# Altium project Control.PrjPcb
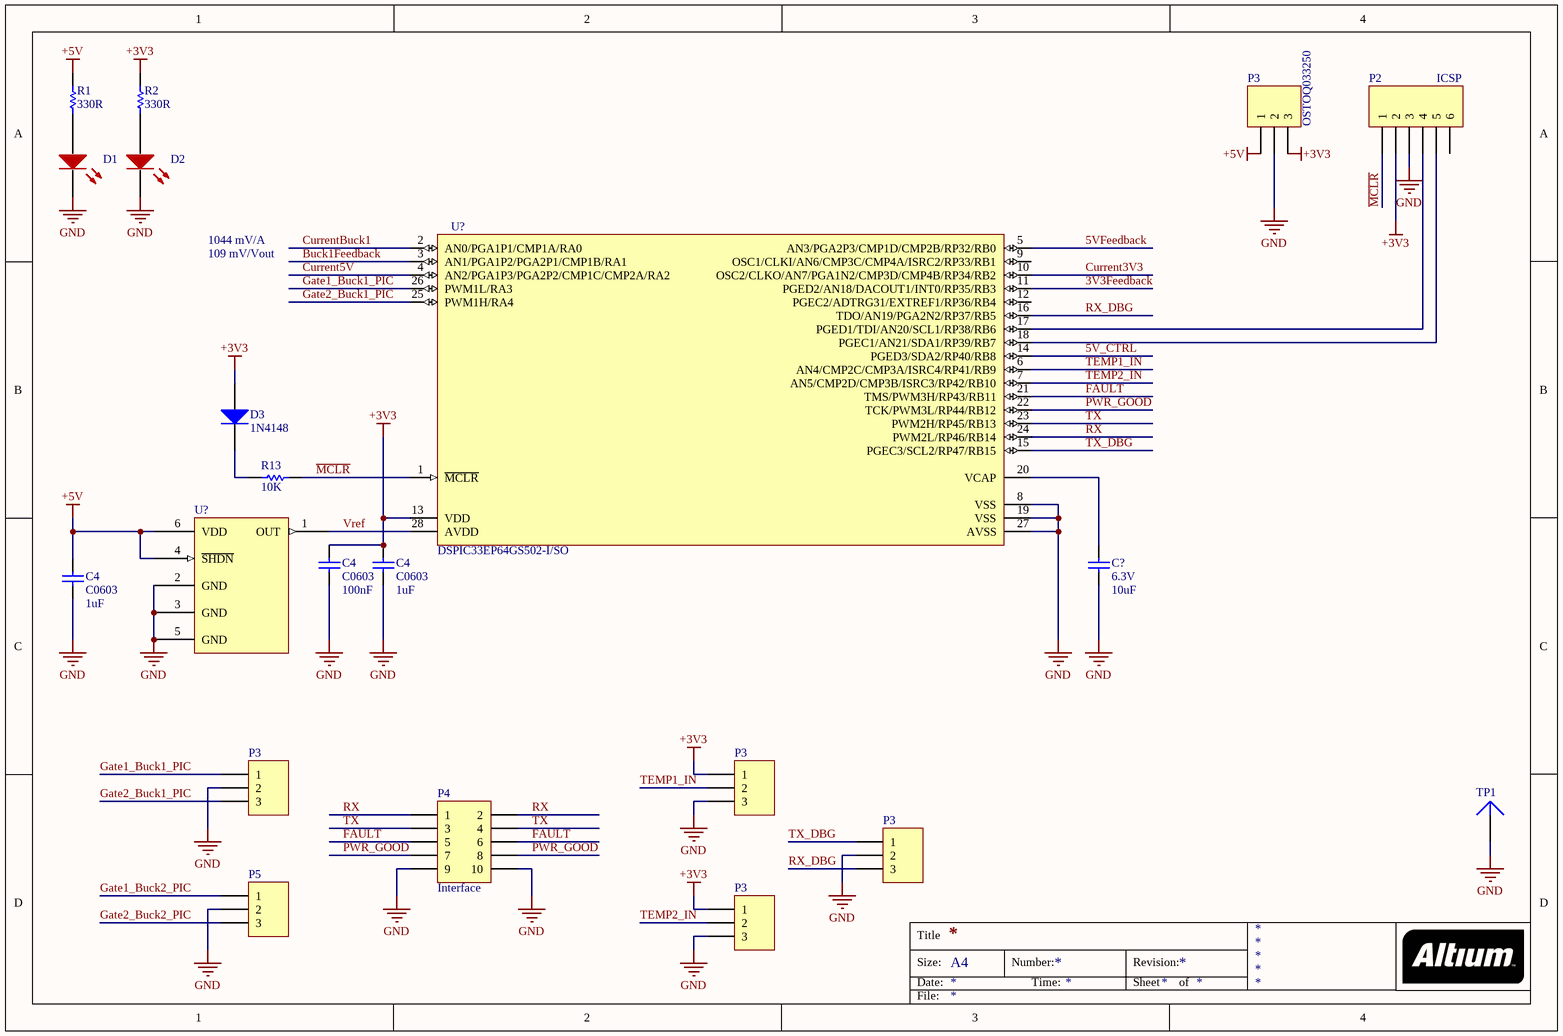
[diagram p0: Control.SchDoc]
2 sheets, 61 parts. Net scope: global (net labels, ports and power ports of the same name join across sheets).
Board file: Control.PcbDoc
Sheets:
  Control.SchDoc
  Remote Feedback.SchDoc

## Sheet Control.SchDoc
size A4

### Parts
(Parts that share a designator on the sheet are numbered #1, #2 ... from top to bottom, then left to right.)
C4#1  C0603  value 100nF  [0603]
C4#2  C0603  value 1uF  [0603]
C4#3  C0603  value 1uF  [0603]
C?#1  6.3V  value 10uF  [C0805]
D1  15-21SURC/S530-A3/TR8  [15-21SURC/S530-A3/TR8]  (value not drawn)
D2  15-21SURC/S530-A3/TR8  [15-21SURC/S530-A3/TR8]  (value not drawn)
D3  1N4148  [SOD80C]
P2  ICSP  [My_1X06]
P3#1  XY2500R-F 3P  [OSTOQ033250]  (value not drawn)
P3#2  Header 3  [My_1X03]  (value not drawn)
P3#3  Header 3  [My_1X03]  (value not drawn)
P3#4  Header 3  [My_1X03]  (value not drawn)
P3#5  Header 3  [My_1X03]  (value not drawn)
P4  Interface  [HDR2X5]
P5  Header 3  [My_1X03]  (value not drawn)
R1  value 330R  [8RB-1206]  (hidden comment: SMD)
R2  value 330R  [8RB-1206]  (hidden comment: SMD)
R13#1  10K  [ERA-0603]
TP1  (no value)  [PIN1]
U?#1  Manufacturer Part Number: DSPIC33EP64GS502-I/SO  [MCHP-SOIC-SO28_N]  (hidden comment: DSPIC33EP64GS502)
U?#2  MCP1501T  [SOT-23-6]  (value not drawn)

### Nets
+3V3: C4#1.1 C4#2.1 D3.1(A) P2.2 P3#1.3 P3#3.1 P3#5.1 R2.1 U?#1.13(VDD)
+5V: C4#3.1 P3#1.1 R1.1 U?#2.4(~{SHDN}) U?#2.6(VDD)
GND: C4#1.2 C4#2.2 C4#3.2 C?#1.1 D1.2 D2.2 P2.3 P3#1.2 P3#2.2 P3#3.3 P3#4.2 P3#5.3 P4.9 P4.10 P5.2 TP1.1 U?#1.8(VSS) U?#1.19(VSS) U?#1.27(AVSS) U?#2.2(GND) U?#2.3(GND) U?#2.5(GND)
3V3Feedback: U?#1.11(PGED2/AN18/DACOUT1/INT0/RP35/RB3)
5V_CTRL: U?#1.14(PGED3/SDA2/RP40/RB8)
5VFeedback: U?#1.5(AN3/PGA2P3/CMP1D/CMP2B/RP32/RB0)
Buck1Feedback: U?#1.3(AN1/PGA1P2/PGA2P1/CMP1B/RA1)
Current3V3: U?#1.10(OSC2/CLKO/AN7/PGA1N2/CMP3D/CMP4B/RP34/RB2)
Current5V: U?#1.4(AN2/PGA1P3/PGA2P2/CMP1C/CMP2A/RA2)
CurrentBuck1: U?#1.2(AN0/PGA1P1/CMP1A/RA0)
FAULT: P4.5 P4.6 U?#1.21(TMS/PWM3H/RP43/RB11)
Gate1_Buck1_PIC: P3#2.1 U?#1.26(PWM1L/RA3)
Gate1_Buck2_PIC: P5.1
Gate2_Buck1_PIC: P3#2.3 U?#1.25(PWM1H/RA4)
Gate2_Buck2_PIC: P5.3
~{MCLR}: P2.1 R13#1.1 U?#1.1(~{MCLR})
PWR_GOOD: P4.7 P4.8 U?#1.22(TCK/PWM3L/RP44/RB12)
RX: P4.1 P4.2 U?#1.24(PWM2L/RP46/RB14)
RX_DBG: P3#4.3 U?#1.16(TDO/AN19/PGA2N2/RP37/RB5)
TEMP1_IN: P3#3.2 U?#1.6(AN4/CMP2C/CMP3A/ISRC4/RP41/RB9)
TEMP2_IN: P3#5.2 U?#1.7(AN5/CMP2D/CMP3B/ISRC3/RP42/RB10)
TX: P4.3 P4.4 U?#1.23(PWM2H/RP45/RB13)
TX_DBG: P3#4.1 U?#1.15(PGEC3/SCL2/RP47/RB15)
Vref: U?#1.28(AVDD) U?#2.1(OUT)
NetC?#1_2: C?#1.2 U?#1.20(VCAP)
NetD1_1: D1.1 R1.2
NetD2_1: D2.1 R2.2
NetD3_2: D3.2(K) R13#1.2
NetP2_4: P2.4 U?#1.17(PGED1/TDI/AN20/SCL1/RP38/RB6)
NetP2_5: P2.5 U?#1.18(PGEC1/AN21/SDA1/RP39/RB7)

Not connected (* = marked no-connect by the designer): P2 6; U?#1 9(OSC1/CLKI/AN6/CMP3C/CMP4A/ISRC2/RP33/RB1) 12(PGEC2/ADTRG31/EXTREF1/RP36/RB4)

### Notes on the sheet
- 1044 mV/A
- 109 mV/Vout
- Title
- Size:
- Date:
- A4
- Number:
- Time:
- Revision:
- Sheet
- of
- File:

### Library data of the parts
C4#1-C4#3 = C0603: C1608X7R1C105K X7R; Note: Footprint corresponds to dimensions for bulk cassette packaging. This case size has tightened tolerances.; Published: 17-Jul-2002; LatestRevisionDate: 19-Mar-2004; LatestRevisionNote: Silkscreen size reduced.; DatasheetDocument: Mar-2001; PackageDocument: Mar-2001; PackageReference: 0603; Publisher: Altium Limited; Code_JEITA: 0603; Code_IPC: 1608 [0603]; ComponentLink1Description: Manufacturer Link; ComponentLink1URL: http://www.kemet.com/; ComponentLink2Description: Datasheet; ComponentLink2URL: http://www.kemet.com/kemet/web/homepage/kechome.nsf/vapubfilesname/F3102TA.pdf/$file/F3102TA.pdf
C?#1 = CDR01: Ceramic Chip Capacitor - MIL-PRF-55681; Published: 17-Jul-2002; LatestRevisionDate: 19-Mar-2004; LatestRevisionNote: Silkscreen size reduced.; DatasheetDocument: Mar-2001; PackageDocument: Mar-2001; PackageReference: C0805; Publisher: Altium Limited; Code_JEITA: 0805; Code_IPC: 2012[0805]; ComponentLink1Description: Manufacturer Link; ComponentLink1URL: http://www.kemet.com/; ComponentLink2Description: Datasheet; ComponentLink2URL: http://www.kemet.com/kemet/web/homepage/kechome.nsf/vapubfilesname/F3102TA.pdf/$file/F3102TA.pdf
D1 D2 = 15-21SURC/S530-A3/TR8 led smd 0805 red
D3 = 1N4148: High Conductance Fast Diode; Published: 8-Jun-2000; LatestRevisionDate: 17-Jul-2002; LatestRevisionNote: Re-released for DXP Platform.; DatasheetDocument: 1997; PackageReference: DO-35; Publisher: Altium Limited; Code_JEDEC: DO-204-AH; ComponentLink1Description: Manufacturer Link; ComponentLink1URL: http://www.fairchildsemi.com/; ComponentLink2Description: Datasheet; ComponentLink2URL: http://www.fairchildsemi.com/ds/1N%2F1N4148.pdf
P2 = Header 6: Header, 6-Pin; LatestRevisionDate: 17-Jul-2002; LatestRevisionNote: Re-released for DXP Platform.; Publisher: Altium Limited
P3#1 = XY2500R-F 3P: HEADER 3P P/CI 90gra VERDE P=3.81MM XY2500R-F; Manufacturer: On Shore Technology Inc.; Material Flammability Rating: UL94 V-0; Voltage - UL: 300V; Current - UL: 10A; Pitch: 0.150" (3.81mm); Number of Levels: 1; Positions Per Level: 3; Header Orientation: Vertical; Contact Tail Length: 0.138" (3.50mm); Supplier 1: Digi-Key; Manufacturer Part Number: OSTOQ033250; Wire Strip Length: -; Termination Style: Solder; Mounting Type: Through Hole; Supplier: Digi-Key; Category: Connectors, Interconnects; Supplier Part Number: ED2820-ND; Voltage - IEC: -; Operating Temperature: -30°C ~ 105°C; Color: Green; Features: -; Ingress Protection: -; Wire Gauge or Range - mm²: -; Insulation Height: 0.362" (9.20mm); Wire Gauge or Range - AWG: -; Plug Wire Entry: -; Screw Size: -; Contact Mating Finish: Tin; Torque - Screw: -; Housing Material: Thermoplastic; Current - IEC: -; Contact Material: Brass; RoHS: RoHS Compliant; Part Status: Active; Packaging: Bulk; Type: Header, Male Pins, Shrouded (4 Side); Number of Positions: 3
P3#2-P3#5 P5 = Header 3: Header, 3-Pin; LatestRevisionDate: 17-Jul-2002; LatestRevisionNote: Re-released for DXP Platform.; Publisher: Altium Limited
P4 = Header 5X2: Header, 5-Pin, Dual row; LatestRevisionDate: 17-Jul-2002; LatestRevisionNote: Re-released for DXP Platform.; Publisher: Altium Limited
R1 R2 = ERJ8BQ: Low Ohmic Value Thick Film Chip Resistor, 0.22 Ohm to 9.1 Ohm Range, 1%, 2% and 5% Tolerance, 1206 Size, 0.33 W; Published: 17-Dec-2003; LatestRevisionDate: 19-Mar-2004; LatestRevisionNote: Silkscreen size reduced.; PackageDocument: Mar-2003; PackageReference: 8RB-1206; Publisher: Altium Limited; Code_IPC: 3216 [1206]; ComponentLink1Description: Manufacturer Link; ComponentLink1URL: http://www.panasonic.com/industrial/components/resistive_products.htm; ComponentLink2Description: Datasheet; ComponentLink2URL: http://www.panasonic.com/industrial/components/pdf/AOA0000CE3.pdf
R13#1 = ERA3Y: Rectangular Thick Film Chip Resistor, 10 Ohm to 330k Ohm Range, 0.1% and 0.5% Tolerance, 0603 Size, 0.063 W; Note: If flow soldering, adjust pad width of PCB Footprint to 0.7 - 0.8 times the width of the resistor.; Published: 17-Dec-2003; LatestRevisionDate: 19-Mar-2004; LatestRevisionNote: Silkscreen size reduced.; PackageDocument: Mar-2003; PackageReference: ERA-0603; Publisher: Altium Limited; Code_IPC: 1608 [0603]; ComponentLink1Description: Manufacturer Link; ComponentLink1URL: http://www.panasonic.com/industrial/components/resistive_products.htm; ComponentLink2Description: Datasheet; ComponentLink2URL: http://www.panasonic.com/industrial/components/pdf/AOA0000CE8.pdf
TP1 = Plug: LatestRevisionDate: 17-Jul-2002; LatestRevisionNote: Re-released for DXP Platform.; Publisher: Altium Limited
U?#1 = DSPIC33EP64GS502: dsPIC dsPIC™ 33EP Microcontroller IC 16-Bit 70 MIPs 64KB (64K x 8) FLASH 28-SOIC; Manufacturer: Microchip Technology; Number of I/O: 21; Peripherals: Brown-out Detect/Reset, POR, PWM, WDT; Oscillator Type: Internal; Speed: 70 MIPs; Voltage - Supply (Vcc/Vdd): 3 V ~ 3.6 V; Data Converters: A/D 12x12b, D/A 1x12b; Connectivity: I²C, IrDA, LIN, SPI, UART/USART; RAM Size: 8K x 8; Package / Case: 28-SOIC (0.295", 7.50mm Width); Supplier Device Package: 28-SOIC; Program Memory Size: 64KB (64K x 8); Operating Temperature: -40°C ~ 85°C (TA); Core Processor: dsPIC; Category: Integrated Circuits (ICs); Program Memory Type: FLASH; Core Size: 16-Bit; Packaging: Tube; EEPROM Size: -; RoHS: RoHS Compliant; Part Status: Active; Supplier: Digi-Key; Supplier Part Number: DSPIC33EP64GS502-I/SO-ND
U?#2 = MCP1501T: Series Voltage Reference IC ±0.08% 20mA SOT-23-6

## Sheet Remote Feedback.SchDoc
size A3
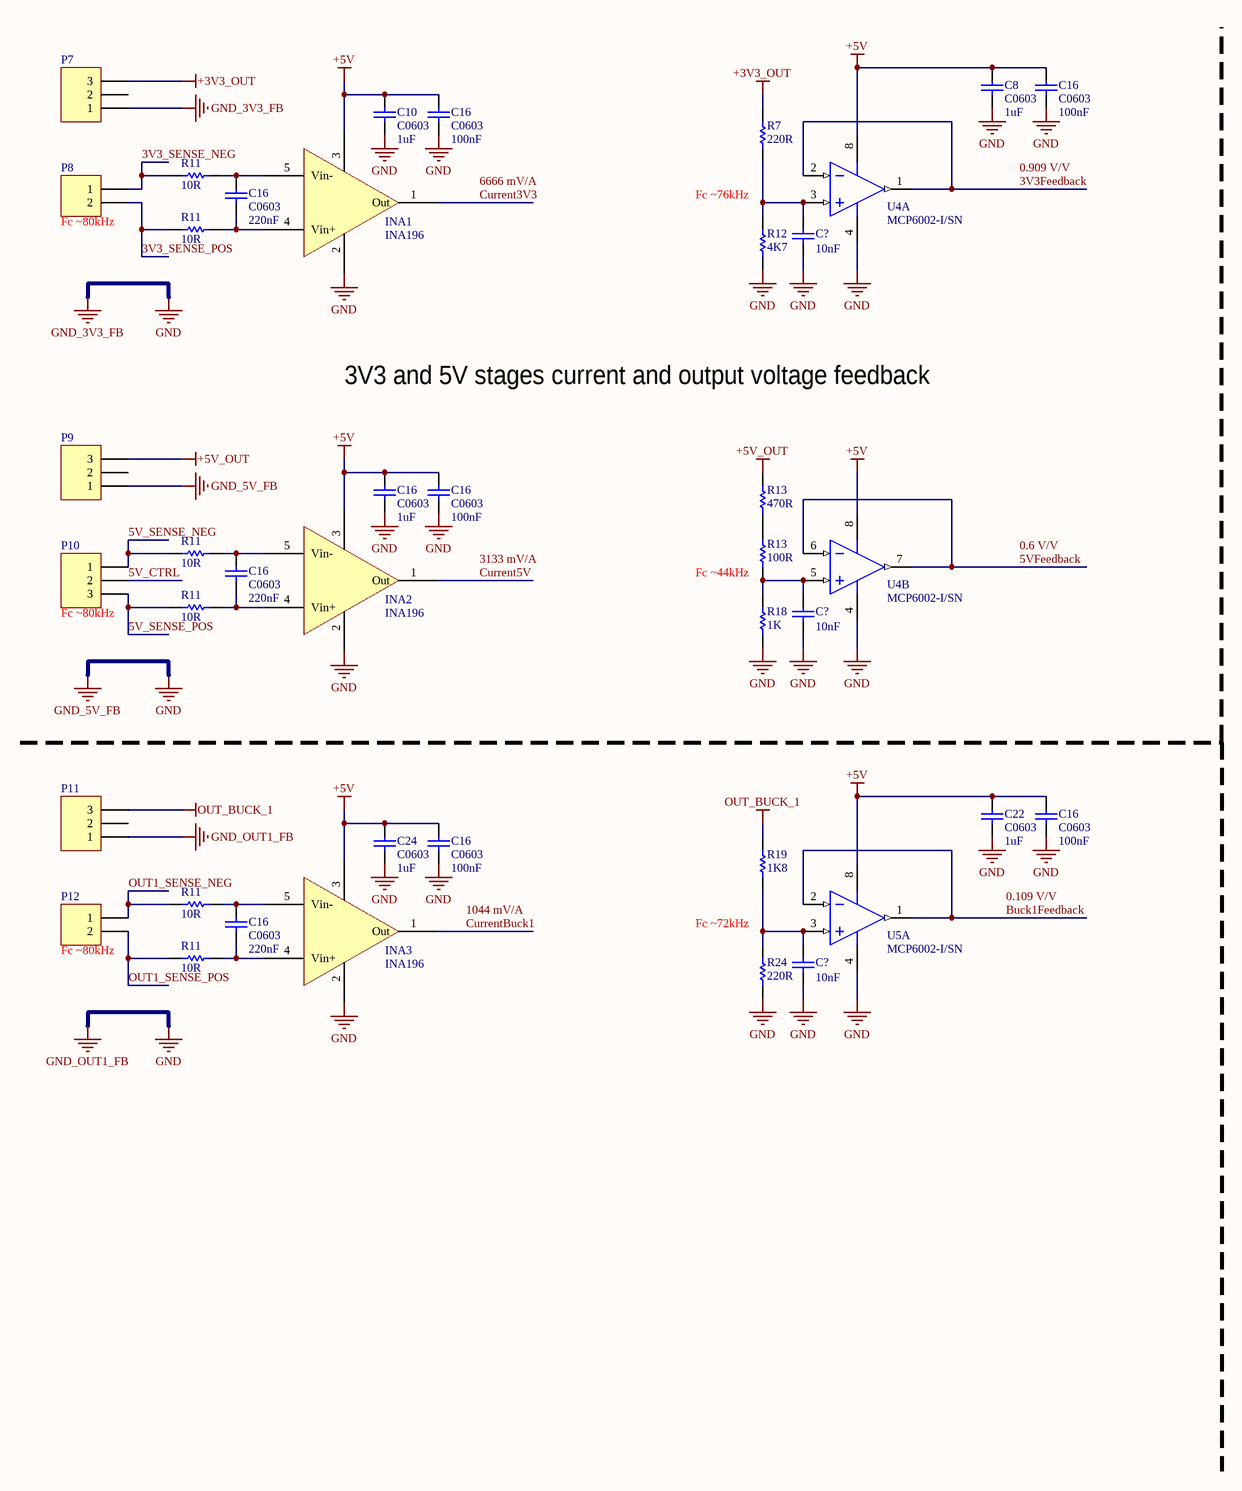
[diagram p1: Remote Feedback.SchDoc]

### Parts
(Parts that share a designator on the sheet are numbered #1, #2 ... from top to bottom, then left to right.)
C8  C0603  value 1uF  [0603]
C10  C0603  value 1uF  [0603]
C16#1  C0603  value 100nF  [0603]
C16#2  C0603  value 100nF  [0603]
C16#3  C0603  value 220nF  [0603]
C16#4  C0603  value 1uF  [0603]
C16#5  C0603  value 100nF  [0603]
C16#6  C0603  value 220nF  [0603]
C16#7  C0603  value 100nF  [0603]
C16#8  C0603  value 100nF  [0603]
C16#9  C0603  value 220nF  [0603]
C22  C0603  value 1uF  [0603]
C24  C0603  value 1uF  [0603]
C?#2  value 10nF  [C0805]  (hidden comment: CDR01)
C?#3  value 10nF  [C0805]  (hidden comment: CDR01)
C?#4  value 10nF  [C0805]  (hidden comment: CDR01)
INA1  INA196  [SOT-23-5]
INA2  INA196  [SOT-23-5]
INA3  INA196  [SOT-23-5]
P7  Header 3  [My_1X03]  (value not drawn)
P8  Header 2  [HDR1X2]  (value not drawn)
P9  Header 3  [My_1X03]  (value not drawn)
P10  Header 3  [My_1X03]  (value not drawn)
P11  Header 3  [My_1X03]  (value not drawn)
P12  Header 2  [HDR1X2]  (value not drawn)
R7  value 220R  [8RB-1206]  (hidden comment: SMD)
R11#1  10R  [ERA-0603]
R11#2  10R  [ERA-0603]
R11#3  10R  [ERA-0603]
R11#4  10R  [ERA-0603]
R11#5  10R  [ERA-0603]
R11#6  10R  [ERA-0603]
R12  value 4K7  [8RB-1206]  (hidden comment: SMD)
R13#2  value 470R  [8RB-1206]  (hidden comment: SMD)
R13#3  value 100R  [8RB-1206]  (hidden comment: SMD)
R18  value 1K  [8RB-1206]  (hidden comment: SMD)
R19  value 1K8  [8RB-1206]  (hidden comment: SMD)
R24  value 220R  [8RB-1206]  (hidden comment: SMD)
U4  MCP6002-I/SN  [SOIC-SN8_N]  (parts A,B of 2)
U5  MCP6002-I/SN  [SOIC-SN8_N]  (part A of 2)

### Nets
+3V3_OUT: P7.3 R7.2
+5V: C8.2 C10.2 C16#1.2 C16#2.2 C16#4.2 C16#5.2 C16#7.2 C16#8.2 C22.2 C24.2 INA1.3 INA2.3 INA3.3 U4.8(VDD) U5.8(VDD)
+5V_OUT: P9.3 R13#2.2
GND: C8.1 C10.1 C16#1.1 C16#2.1 C16#4.1 C16#5.1 C16#7.1 C16#8.1 C22.1 C24.1 C?#2.1 C?#3.1 C?#4.1 INA1.2(GND) INA2.2(GND) INA3.2(GND) P7.1 P9.1 P11.1 R12.1 R18.1 R24.1 U4.4(VSS) U5.4(VSS)  [also labelled GND_3V3_FB, GND_5V_FB, GND_OUT1_FB]
OUT_BUCK_1: P11.3 R19.2
3V3_SENSE_NEG: P8.1 R11#1.2
3V3_SENSE_POS: P8.2 R11#2.2
3V3Feedback: U4.1(VOUTA) U4.2(VINA-)
5V_CTRL: P10.2
5V_SENSE_NEG: P10.1 R11#3.2
5V_SENSE_POS: P10.3 R11#4.2
5VFeedback: U4.6(VINB-) U4.7(VOUTB)
Buck1Feedback: U5.1(VOUTA) U5.2(VINA-)
Current3V3: INA1.1(Out)
Current5V: INA2.1(Out)
CurrentBuck1: INA3.1(Out)
OUT1_SENSE_NEG: P12.1 R11#5.2
OUT1_SENSE_POS: P12.2 R11#6.2
NetC16#3_1: C16#3.1 INA1.4(Vin+) R11#2.1
NetC16#3_2: C16#3.2 INA1.5(Vin-) R11#1.1
NetC16#6_1: C16#6.1 INA2.4(Vin+) R11#4.1
NetC16#6_2: C16#6.2 INA2.5(Vin-) R11#3.1
NetC16#9_1: C16#9.1 INA3.4(Vin+) R11#6.1
NetC16#9_2: C16#9.2 INA3.5(Vin-) R11#5.1
NetC?#2_2: C?#2.2 R7.1 R12.2 U4.3(VINA+)
NetC?#3_2: C?#3.2 R13#3.1 R18.2 U4.5(VINB+)
NetC?#4_2: C?#4.2 R19.1 R24.2 U5.3(VINA+)
NetR13#2_1: R13#2.1 R13#3.2

Not connected (* = marked no-connect by the designer): P7 2; P9 2; P11 2

### Notes on the sheet
- (near P8) Fc ~80kHz
- Fc ~76kHz
- 3V3 and 5V stages current and output voltage feedback
- (near R13#3) Fc ~44kHz
- (near P10) Fc ~80kHz
- (near P12) Fc ~80kHz
- Fc ~72kHz
- Labels drawn without touching a wire or pin: 0.6 V/V, 0.109 V/V, 0.909 V/V, 1044 mV/A, 3133 mV/A, 6666 mV/A

### Library data of the parts
C8 C10 C16#1-C16#9 C22 C24 = C0603: as C4#1 on sheet Control; Published: 17-Jul-2002; LatestRevisionDate: 19-Mar-2004; LatestRevisionNote: Silkscreen size reduced.; DatasheetDocument: Mar-2001; PackageDocument: Mar-2001; PackageReference: 0603; Publisher: Altium Limited; Code_JEITA: 0603; Code_IPC: 1608 [0603]; ComponentLink1Description: Manufacturer Link; ComponentLink1URL: http://www.kemet.com/; ComponentLink2Description: Datasheet; ComponentLink2URL: http://www.kemet.com/kemet/web/homepage/kechome.nsf/vapubfilesname/F3102TA.pdf/$file/F3102TA.pdf
C?#2-C?#4 = CDR01: Ceramic Chip Capacitor - MIL-PRF-55681; Published: 17-Jul-2002; LatestRevisionDate: 19-Mar-2004; LatestRevisionNote: Silkscreen size reduced.; DatasheetDocument: Mar-2001; PackageDocument: Mar-2001; PackageReference: C0805; Publisher: Altium Limited; Code_JEITA: 0805; Code_IPC: 2012[0805]; ComponentLink1Description: Manufacturer Link; ComponentLink1URL: http://www.kemet.com/; ComponentLink2Description: Datasheet; ComponentLink2URL: http://www.kemet.com/kemet/web/homepage/kechome.nsf/vapubfilesname/F3102TA.pdf/$file/F3102TA.pdf
INA1-INA3 = INA196: Current Shunt Monitor −16 V to +80 V Common-Mode Range
P7 P9-P11 = Header 3: Header, 3-Pin; LatestRevisionDate: 17-Jul-2002; LatestRevisionNote: Re-released for DXP Platform.; Publisher: Altium Limited
P8 P12 = Header 2: Header, 2-Pin; LatestRevisionDate: 17-Jul-2002; LatestRevisionNote: Re-released for DXP Platform.; Publisher: Altium Limited
R7 R12 R13#2 R13#3 R18 R19 R24 = ERJ8BQ: as R1 on sheet Control; Published: 17-Dec-2003; LatestRevisionDate: 19-Mar-2004; LatestRevisionNote: Silkscreen size reduced.; PackageDocument: Mar-2003; PackageReference: 8RB-1206; Publisher: Altium Limited; Code_IPC: 3216 [1206]; ComponentLink1Description: Manufacturer Link; ComponentLink1URL: http://www.panasonic.com/industrial/components/resistive_products.htm; ComponentLink2Description: Datasheet; ComponentLink2URL: http://www.panasonic.com/industrial/components/pdf/AOA0000CE3.pdf
R11#1-R11#6 = ERA3Y: as R13#1 on sheet Control; Published: 17-Dec-2003; LatestRevisionDate: 19-Mar-2004; LatestRevisionNote: Silkscreen size reduced.; PackageDocument: Mar-2003; PackageReference: ERA-0603; Publisher: Altium Limited; Code_IPC: 1608 [0603]; ComponentLink1Description: Manufacturer Link; ComponentLink1URL: http://www.panasonic.com/industrial/components/resistive_products.htm; ComponentLink2Description: Datasheet; ComponentLink2URL: http://www.panasonic.com/industrial/components/pdf/AOA0000CE8.pdf
U4 U5 = MCP6002-I/SN: 1 MHz, Low-Power Operational Amplifier, 8-Pin SOIC, Industrial Temperature; Published: 29-Jan-2009; LatestRevisionDate: 02-Dec-2009; LatestRevisionNote: Updated to datasheet revision J, Nov-2009; DatasheetVersion: revJ, Nov-2009; PackageVersion: revBB, Aug-2009; PackageReference: SOIC-SN8; Publisher: Altium Limited; PackageDescription: 8-Lead Plastic Small Outline (SN) - Narrow, 3.90mm Body [SOIC]; Supplier 1: Digi-Key; Supplier Part Number 1: MCP6002-I/SN-ND; Supplier 2: Farnell; Supplier Part Number 2: 1292246; Code_JEDEC: MS-012; Code_IPC: SOIC127P600-8; ComponentLink1Description: Datasheet; ComponentLink1URL: http://ww1.microchip.com/downloads/en/DeviceDoc/21733j.pdf; ComponentLink2Description: Packaging Specification; ComponentLink2URL: http://www.microchip.com/stellent/groups/techpub_sg/documents/packagingspec/en012702.pdf; ComponentLink3Description: Microchip.com Home; ComponentLink3URL: http://www.microchip.com/

## Nets that join several sheets
+5V: Control (5 pins), Remote Feedback (15 pins)
GND: Control (22 pins), Remote Feedback (24 pins)
3V3Feedback: Control (U?#1.11), Remote Feedback (U4.1 U4.2)
5V_CTRL: Control (U?#1.14), Remote Feedback (P10.2)
5VFeedback: Control (U?#1.5), Remote Feedback (U4.6 U4.7)
Buck1Feedback: Control (U?#1.3), Remote Feedback (U5.1 U5.2)
Current3V3: Control (U?#1.10), Remote Feedback (INA1.1)
Current5V: Control (U?#1.4), Remote Feedback (INA2.1)
CurrentBuck1: Control (U?#1.2), Remote Feedback (INA3.1)